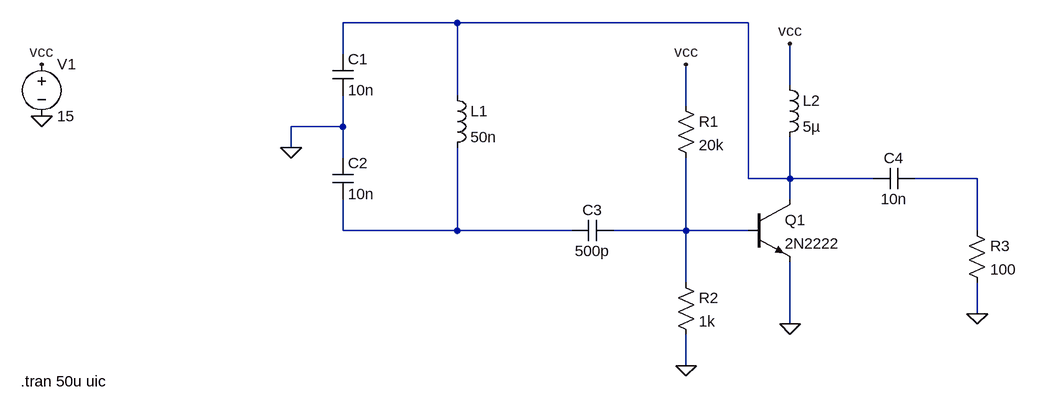
[diagram p0: schematic colpitts.asc]
colpitts.asc, the LTspice schematic file:
Version 4
SHEET 1 2088 680
WIRE 864 -128 688 -128
WIRE 1312 -128 864 -128
WIRE 688 -80 688 -128
WIRE 1376 -32 1376 -96
WIRE 864 -16 864 -128
WIRE 1216 0 1216 -64
WIRE 688 32 688 -16
WIRE 688 32 608 32
WIRE 608 64 608 32
WIRE 688 80 688 32
WIRE 1312 112 1312 -128
WIRE 1376 112 1376 48
WIRE 1376 112 1312 112
WIRE 1504 112 1376 112
WIRE 1664 112 1568 112
WIRE 1376 144 1376 112
WIRE 688 192 688 144
WIRE 864 192 864 64
WIRE 864 192 688 192
WIRE 1040 192 864 192
WIRE 1216 192 1216 80
WIRE 1216 192 1104 192
WIRE 1312 192 1216 192
WIRE 1664 192 1664 112
WIRE 1216 272 1216 192
WIRE 1664 320 1664 272
WIRE 1376 336 1376 240
WIRE 1216 400 1216 352
FLAG 224 -64 vcc
FLAG 224 16 0
FLAG 608 64 0
FLAG 1216 400 0
FLAG 1216 -64 vcc
FLAG 1376 -96 vcc
FLAG 1376 336 0
FLAG 1664 320 0
SYMBOL voltage 224 -80 R0
WINDOW 123 0 0 Left 0
WINDOW 39 0 0 Left 0
SYMATTR InstName V1
SYMATTR Value 15
SYMBOL cap 672 -80 R0
SYMATTR InstName C1
SYMATTR Value 10n
SYMBOL cap 672 80 R0
SYMATTR InstName C2
SYMATTR Value 10n
SYMBOL ind 848 -32 R0
SYMATTR InstName L1
SYMATTR Value 50n
SYMBOL cap 1104 176 R90
WINDOW 0 0 32 VBottom 2
WINDOW 3 32 32 VTop 2
SYMATTR InstName C3
SYMATTR Value 500p
SYMBOL res 1200 -16 R0
SYMATTR InstName R1
SYMATTR Value 20k
SYMBOL res 1200 256 R0
SYMATTR InstName R2
SYMATTR Value 1k
SYMBOL npn 1312 144 R0
SYMATTR InstName Q1
SYMATTR Value 2N2222
SYMBOL ind 1360 -48 R0
SYMATTR InstName L2
SYMATTR Value 5µ
SYMBOL cap 1568 96 R90
WINDOW 0 0 32 VBottom 2
WINDOW 3 32 32 VTop 2
SYMATTR InstName C4
SYMATTR Value 10n
SYMBOL res 1648 176 R0
SYMATTR InstName R3
SYMATTR Value 100
TEXT 192 424 Left 2 !.tran 50u uic

The netlist it stands for:
* colpitts.asc
V1 vcc 0 15
C1 N001 0 10n
C2 0 N003 10n
L1 N001 N003 50n
C3 N004 N003 500p
R1 vcc N004 20k
R2 N004 0 1k
Q1 N001 N004 0 0 2N2222
L2 vcc N001 5µ
C4 N002 N001 10n
R3 N002 0 100
.model NPN NPN
.model PNP PNP
.lib standard.bjt
.tran 50u uic
.backanno
.end